# Altium schematic sheet Schematic.SchDoc: Đo dòng và áp không sử dụng ADC
size A3; DrawnBy: Đinh Anh Tú; Organization: Thiết kế Thiết bị đo 20211:; Address1: Phạm Thị Trang; Address2: Đào Phi Dương; Address3: Đinh Anh Tú; DocumentNumber: 01; Revision: V2.1; SheetNumber: 01; SheetTotal: 01
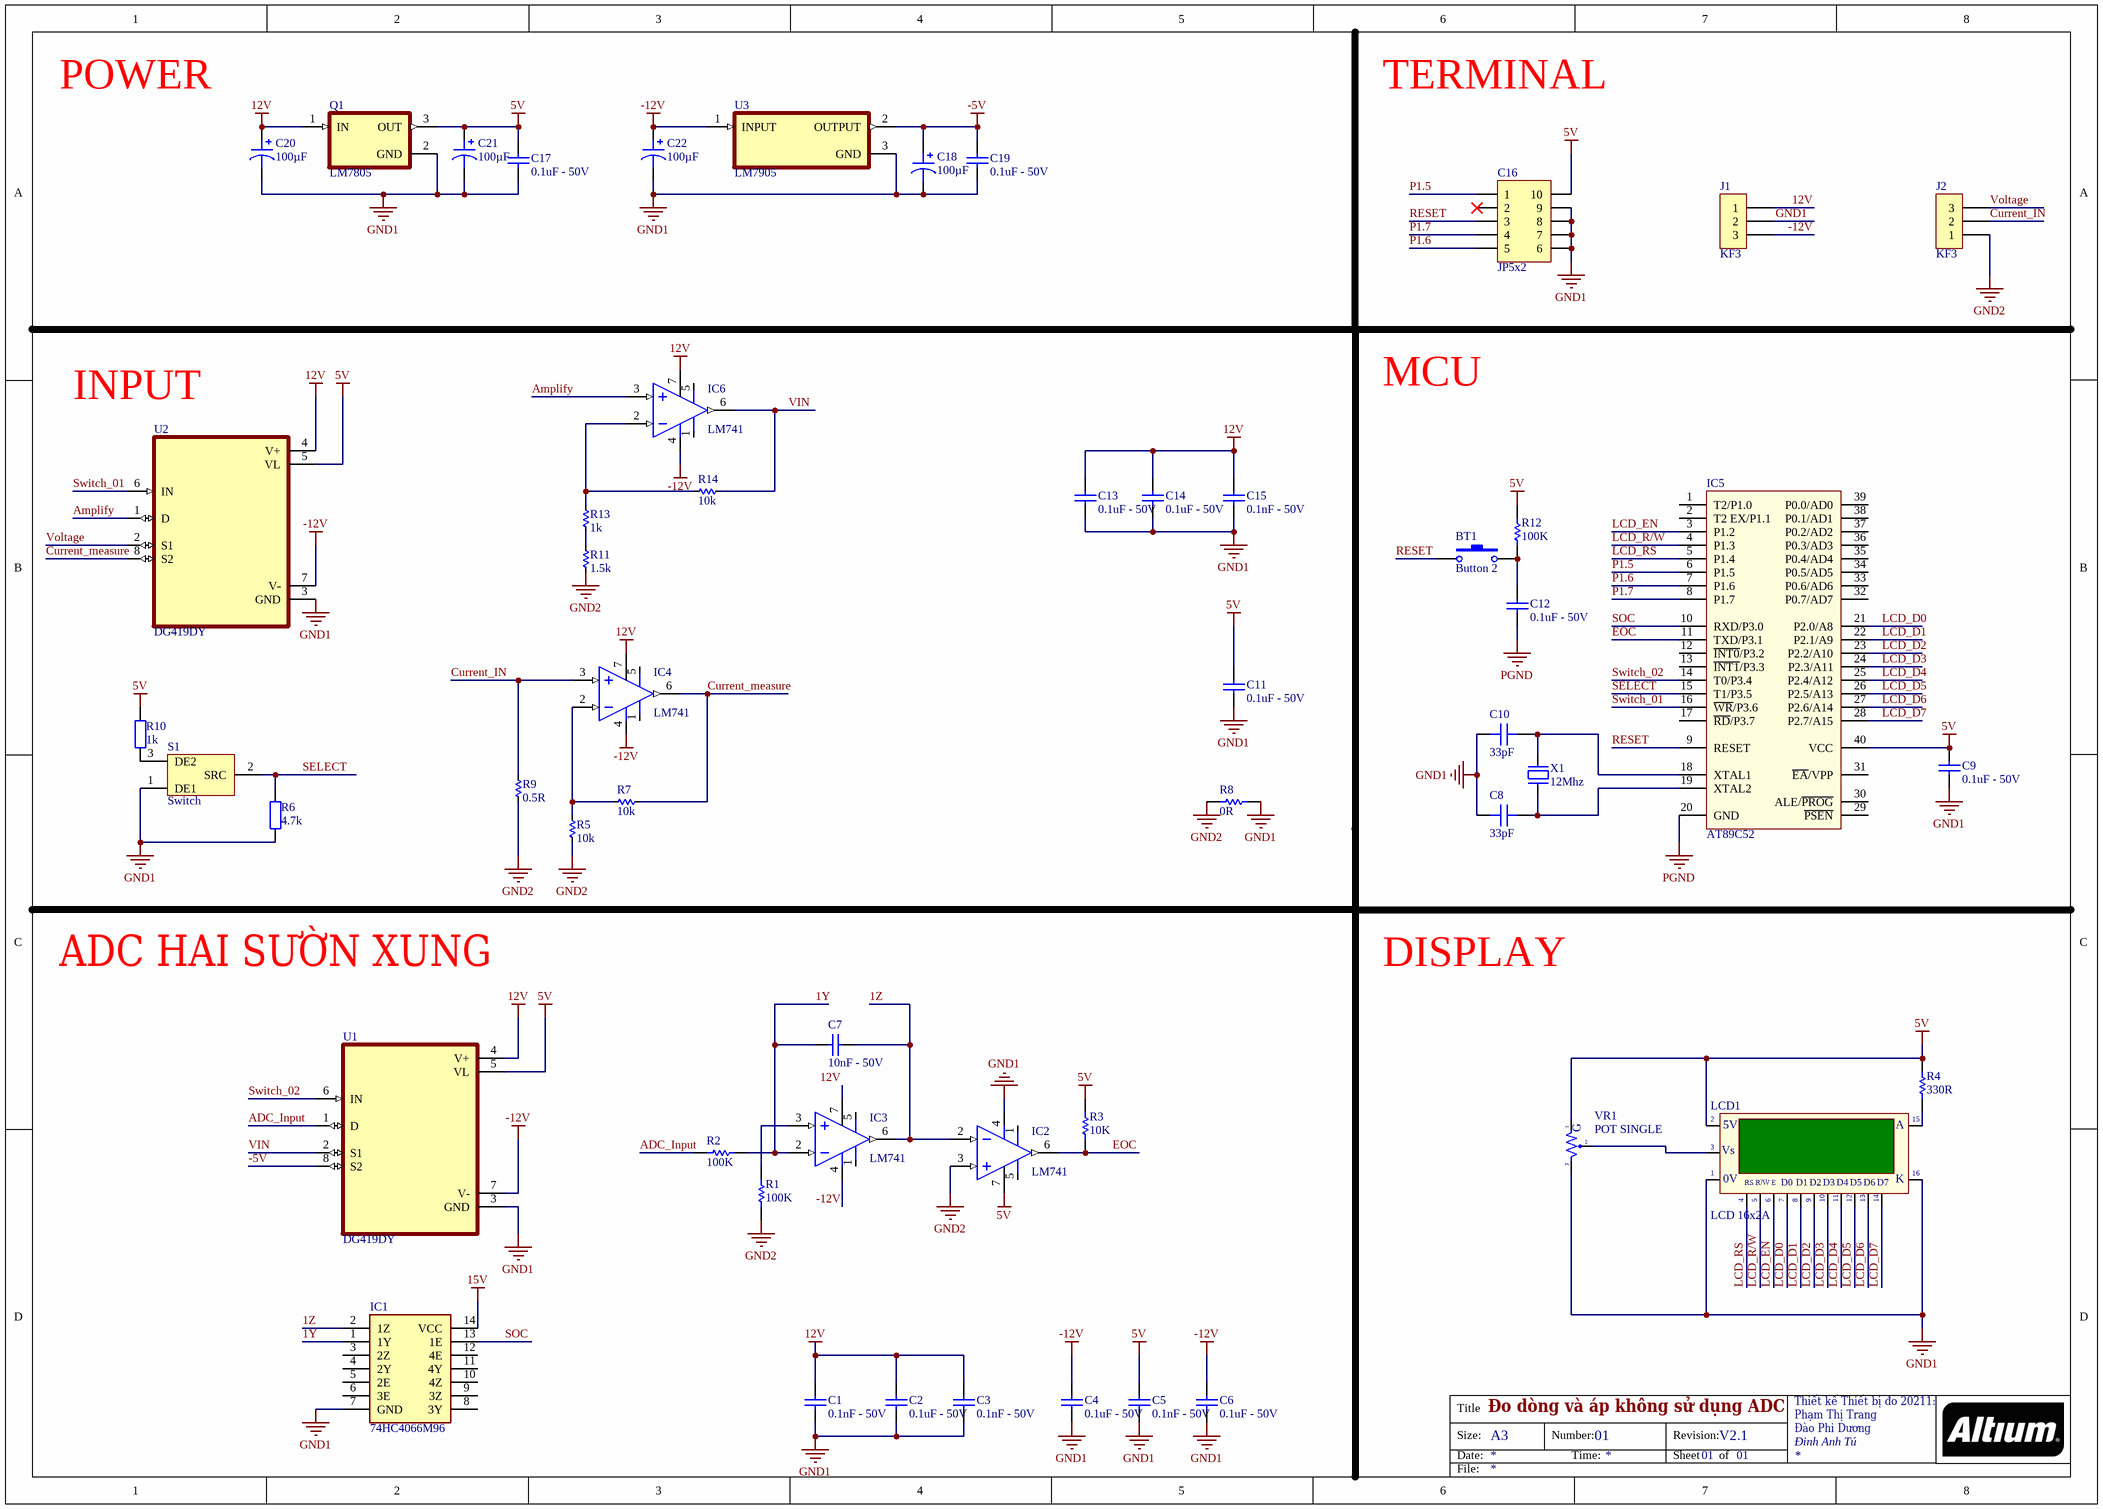
[diagram p0: Schematic.SchDoc]

## Parts
BT1  Button 2  [4341x10438x6_6x3.5x4.3]
C1  0.1nF - 50V  [CAPC_0603_N]
C2  0.1uF - 50V  [CAPC_0603_N]
C3  0.1nF - 50V  [CAPC_0603_N]
C4  0.1uF - 50V  [CAPC_0603_N]
C5  0.1nF - 50V  [CAPC_0603_N]
C6  0.1uF - 50V  [CAPC_0603_N]
C7  10nF - 50V  [CAPC_0603_N]
C8  33pF  [CAP 0805_2012]
C9  0.1uF - 50V  [CAPC_0603_N]
C10  33pF  [CAP 0805_2012]
C11  0.1uF - 50V  [CAPC_0603_N]
C12  0.1uF - 50V  [CAPC_0603_N]
C13  0.1uF - 50V  [CAPC_0603_N]
C14  0.1uF - 50V  [CAPC_0603_N]
C15  0.1nF - 50V  [CAPC_0603_N]
C16  JP5x2  [JP5-D2T]
C17  0.1uF - 50V  [CAPC_0603_N]
C18  100µF  [CAP TH ALUM ELEC D8.00mm S3.50mm H12.50mm]
C19  0.1uF - 50V  [CAPC_0603_N]
C20  100µF  [CAP TH ALUM ELEC D8.00mm S3.50mm H12.50mm]
C21  100µF  [CAP TH ALUM ELEC D8.00mm S3.50mm H12.50mm]
C22  100µF  [CAP TH ALUM ELEC D8.00mm S3.50mm H12.50mm]
IC1  74HC4066M96  [SOIC127P600X175-14N]
IC2  LM741  [SO8]
IC3  LM741  [SO8]
IC4  LM741  [SO8]
IC5  AT89C52  [DIP40/W0.6]
IC6  LM741  [SO8]
J1  KF3  [KF3-5.08]
J2  KF3  [KF3-5.08]
LCD1  LCD 16x2A  [JP16-C1T]
Q1  LM7805  [TO254P1054X470X2600-3]
R1  100K  [RESC_0805_N]
R2  100K  [RESC_0805_N]
R3  10K  [RESC_0603_N]
R4  330R  [RESC_0603_N]
R5  10k  [RES-SMD-0805]
R6  value 4.7k  [DIEN TRO 1/4 W]  (hidden comment: R0.4W)
R7  10k  [RES-SMD-0805]
R8  0R  [RESC_0805_N]
R9  0.5R  [RES-SMD-1206]
R10  value 1k  [DIEN TRO 1/4 W]  (hidden comment: R0.4W)
R11  1.5k  [RES-SMD-0805]
R12  100K  [RESC_0805_N]
R13  1k  [RES-SMD-0805]
R14  10k  [RES-SMD-0805]
S1  Switch  [Switch]
U1  DG419DY  [SOIC127P600X175-8N]
U2  DG419DY  [SOIC127P600X175-8N]
U3  LM7905  [TO254P1054X470X1955-3]
VR1  POT SINGLE  [POTSD 3296V]
X1  12Mhz  [XT2]

## Nets
5V: C5.1 C9.1 C11.1 C16.10 C17.2 C21.1 IC2.7(+V) IC5.40(VCC) LCD1.2(VDD) Q1.3(OUT) R3.1 R4.1 R10.2 R12.1 U1.5(VL) U2.5(VL) VR1.1
12V: C1.1 C2.1 C3.1 C13.1 C14.1 C15.1 C20.1 IC3.7(+V) IC4.7(+V) IC6.7(+V) J1.1 Q1.1(IN) U1.4(V+) U2.4(V+)
15V: IC1.14(VCC)
-5V: C18.1 C19.2 U1.8(S2) U3.2(OUTPUT)
-12V: C4.1 C6.1 C22.1 IC3.4(-V) IC4.4(-V) IC6.4(-V) J1.3 U1.7(V-) U2.7(V-) U3.1(INPUT)
GND1: C1.2 C2.2 C3.2 C4.2 C5.2 C6.2 C8.1 C9.2 C10.1 C11.2 C13.2 C14.2 C15.2 C16.6 C16.7 C16.8 C16.9 C17.1 C18.2 C19.1 C20.2 C21.2 C22.2 IC1.7(GND) IC2.4(-V) J1.2 LCD1.1(GND) LCD1.16(K) Q1.2(GND) R6.1 R8.1 S1.1(DE1) U1.3(GND) U2.3(GND) U3.3(GND) VR1.3
GND2: IC2.3(IN+) J2.1 R1.2 R5.2 R8.2 R9.1 R11.2
PGND: C12.1 IC5.20(GND)
1Y: C7.1 IC1.1(1Y) IC3.2(IN-) R2.1
1Z: C7.2 IC1.2(1Z) IC2.2(IN-) IC3.6(OUT)
ADC_Input: R2.2 U1.1(D)
Amplify: IC6.3(IN+) U2.1(D)
Current_IN: IC4.3(IN+) J2.2 R9.2
Current_measure: IC4.6(OUT) R7.2 U2.8(S2)
EOC: IC2.6(OUT) IC5.11(TXD/P3.1) R3.2
LCD_D0: IC5.21(P2.0/A8) LCD1.7(D0)
LCD_D1: IC5.22(P2.1/A9) LCD1.8(D1)
LCD_D2: IC5.23(P2.2/A10) LCD1.9(D2)
LCD_D3: IC5.24(P2.3/A11) LCD1.10(D3)
LCD_D4: IC5.25(P2.4/A12) LCD1.11(D4)
LCD_D5: IC5.26(P2.5/A13) LCD1.12(D5)
LCD_D6: IC5.27(P2.6/A14) LCD1.13(D6)
LCD_D7: IC5.28(P2.7/A15) LCD1.14(D7)
LCD_EN: IC5.3(P1.2) LCD1.6(~{EN})
LCD_R/~{W}: IC5.4(P1.3) LCD1.5(R/~{W})
LCD_RS: IC5.5(P1.4) LCD1.4(RS)
P1.5: C16.1 IC5.6(P1.5)
P1.6: C16.5 IC5.7(P1.6)
P1.7: C16.4 IC5.8(P1.7)
RESET: BT1.1 C16.3 IC5.9(RESET)
SELECT: IC5.15(T1/P3.5) R6.2 S1.2(SRC)
SOC: IC1.13(1E) IC5.10(RXD/P3.0)
Switch_01: IC5.16(~{WR}/P3.6) U2.6(IN)
Switch_02: IC5.14(T0/P3.4) U1.6(IN)
VIN: IC6.6(OUT) R14.2 U1.2(S1)
Voltage: J2.3 U2.2(S1)
NetBT1_2: BT1.2 C12.2 R12.2
NetC8_2: C8.2 IC5.19(XTAL2) X1.1
NetC10_2: C10.2 IC5.18(XTAL1) X1.2
NetIC3_3: IC3.3(IN+) R1.1
NetIC4_2: IC4.2(IN-) R5.1 R7.1
NetIC6_2: IC6.2(IN-) R13.1 R14.1
NetLCD1_3: LCD1.3(VEE) VR1.2
NetLCD1_15: LCD1.15(A) R4.2
NetR10_1: R10.1 S1.3(DE2)
NetR11_1: R11.1 R13.2

Not connected (* = marked no-connect by the designer): C16 2*; IC1 3(2Z) 4(2Y) 5(2E) 6(3E) 8(3Y) 9(3Z) 10(4Z) 11(4Y) 12(4E); IC2 1(Vos) 5(Vos); IC3 1(Vos) 5(Vos); IC4 1(Vos) 5(Vos); IC5 1(T2/P1.0) 2(T2_EX/P1.1) 12(~{INT0}/P3.2) 13(~{INT1}/P3.3) 17(~{RD}/P3.7) 29(~{PSEN}) 30(ALE/~{PROG}) 31(~{EA}/VPP) 32(P0.7/AD7) 33(P0.6/AD6) 34(P0.5/AD5) 35(P0.4/AD4) 36(P0.3/AD3) 37(P0.2/AD2) 38(P0.1/AD1) 39(P0.0/AD0); IC6 1(Vos) 5(Vos); S1 4 5

## Notes on the sheet
- POWER
- TERMINAL
- (near U2) INPUT
- MCU
- ADC HAI SƯỜN XUNG
- DISPLAY
- Title
- Size:
- Date:
- A3
- Number:
- Time:
- Revision:
- Sheet
- of
- File:
- (in symbol LCD16x2A) 5V; Vs; |; 0V; R/W; E
- (in symbol POT SINGLE) G

## Library data of the parts
BT1 = Button 2: Button 2 Pin no Sheld
C1 C3 C5 C15 = CL10B101KB8NNNC: CAP CER 100PF 50V X7R 0603; Manufacture: Samsung Electro-Mechanics; Detailed Value: 0.1nF - 50V - 0603; PROJECT: KHO; Partnumber: CL10B101KB8NNNC; Value: 0.1nF - 50V; Creator: ThangND; Category: Capacitor; Mounting type: SMD
C2 C9 C12-C14 C17 C19 = C0603X7R104K500NT: CAP CER 0.1UF 50V X7R 0603; Manufacture: Hottech; Detailed Value: 0.1uF - 50V - 0603; PROJECT: KHO; Partnumber: C0603X7R104K500NT; Value: 0.1uF - 50V; Creator: ThangND; Category: Capacitor; Mounting type: SMD
C4 C6 C11 = CL10B104KB8NNNC: CAP CER 0.1UF 50V X7R 0603; Manufacture: Samsung Electro-Mechanics; Detailed Value: 0.1uF - 50V - 0603; PROJECT: KHO; Partnumber: CL10B104KB8NNNC; Value: 0.1uF - 50V; Creator: ThangND; Category: Capacitor; Mounting type: SMD
C7 = C0603X7R103J500NT: CAP CER 10000PF 50V X7R 0603; Manufacture: Hottech; Detailed Value: 10nF - 50V - 0603; PROJECT: KHO; Partnumber: C0603X7R103J500NT; Value: 10nF - 50V; Creator: ThangND; Category: Capacitor; Mounting type: SMD
C8 C10 = CBR08C330JAGAC: CAP CER 33PF 250V C0G/NP0 0805; Manufacturer: KEMET; Temperature Coefficient: C0G, NP0; Tolerance: ±5%; Part Number: CBR08C330JAGAC; Value: 33pF; Applications: RF, Microwave, High Frequency; Capacitance: 33pF; ComponentLink1Description: Datasheet; ComponentLink1URL: https://api.kemet.com/component-edge/download/datasheet/CBR08C330JAGAC.pdf; ComponentLink2Description: DigiKey Link; ComponentLink2URL: http://digikey.com/product-detail/en/kemet/CBR08C330JAGAC/399-6202-1-ND/2732182; Device Package: 0805 (2012 Metric); Features: High Q, Low Loss, Ultra Low ESR; LastUpdated: 9/2/2020 1:04:42 AM; Lifecycle Status: Active; Minimum Order: 1; Mounting Type: Surface Mount, MLCC; Operating Temperature: -55°C ~ 125°C; Package / Case: 0805 (2012 Metric); Packaging: TapeAndReel; PartId: 2409; Part Status: Active; Price: 0.44; Series: CBR-SMD RF C0G; Size / Dimension: 0.079" L x 0.049" W (2.00mm x 1.25mm); Supplier 1: DigiKey; Supplier Part Number 1: 399-6202-1-ND; Thickness (Max): 0.035" (0.88mm); Voltage - Rated: 250V
C16 = JP5x2: WR-PHD 2.54 mm Dual Socket Header; Manufacturer: W¨¹rth Elektronik eiSos GmbH; partNo: 61301021821; ComponentLink1 Description: Manufacturer; ComponentLink2 Description: Datasheet; NoPins: 10; Created Date: 29 March 2013; ComponentLink1URL: http://www.we-online.com; ComponentLink2URL: http://katalog.we-online.de/em/datasheet/6130xx21821.pdf; Created by: Karrer Zheng
C18 C20-C22 = ECA-1HM101: CAP ALUM 100UF 20% 50V RADIAL; Manufacturer: Panasonic Electronic Components; Lifetime @ Temp.: 2000 Hrs @ 85°C; Polarization: Polar; Ripple Current @ High Frequency: 425mA @ 10kHz; Ripple Current @ Low Frequency: 250mA @ 120Hz; Part Number: ECA-1HM101; Applications: General Purpose; Capacitance: 100µF; ComponentLink1Description: Datasheet; ComponentLink1URL: //media.digikey.com/pdf/Data%20Sheets/Panasonic%20Electronic%20Components/ECA-xxM%20Series,TypeA.pdf; ComponentLink2Description: DigiKey Link; ComponentLink2URL: http://digikey.com/product-detail/en/panasonic-electronic-components/ECA-1HM101/P5182-ND/245041; Device Package: Radial, Can; Height - Seated (Max): 0.492" (12.50mm); LastUpdated: 9/7/2020 5:24:52 AM; Lead Spacing: 0.138" (3.50mm); Lifecycle Status: Active; Minimum Order: 1; Mounting Type: Through Hole; Operating Temperature: -40°C ~ 85°C; Package / Case: Radial, Can; Packaging: Bulk; PartId: 7199; Part Status: Active; Price: 0.31; Series: M; Size / Dimension: 0.315" Dia (8.00mm); Supplier 1: DigiKey; Supplier Part Number 1: P5182-ND; Tolerance: ±20%; Value: 100µF; Voltage - Rated: 50V
IC1 = CD74HC4066M96: Integrated Circuit; Manufacturer_Name: Texas Instruments; Datasheet Link: http://www.ti.com/lit/gpn/cd74hc4066; Height: 1.75mm; Manufacturer_Part_Number: CD74HC4066M96; Mouser Part Number: 595-CD74HC4066M96; Mouser Price/Stock: https://www.mouser.co.uk/ProductDetail/Texas-Instruments/CD74HC4066M96?qs=3pnr37ZAbK%2F2%2FQ8j7WB7Tw%3D%3D; Arrow Part Number: CD74HC4066M96; Arrow Price/Stock: https://www.arrow.com/en/products/cd74hc4066m96/texas-instruments
IC2-IC4 IC6 = LM741: Single OA
IC5 = AT89C52: Atmel AT89C52, 8k Byte Flash Memory , 40 Pin; Value: AT89C52
J1 J2 = KF3: Manufacturer: Würth Elektronik eiSos GmbH; partNo: 691103110003; ComponentLink1 Description: Manufacturer; ComponentLink2 Description: Datasheet; NoPins: 3; Created Date: 29 October 2013; ComponentLink1URL: http://www.we-online.com; ComponentLink2URL: http://katalog.we-online.de/em/datasheet/6911031100xx.pdf; Created by: Karrer Zheng
LCD1 = LCD16x2A: LCD dipslay 16 char, 2 line; Value: LCD16x2A
Q1 = LM7805CT/NOPB: Linear Voltage Regulator IC 1 Output 1A TO-220-3; MF: ON Semiconductor; MP: LM7805CT; SnapEDA_Link: https://www.snapeda.com/parts/LM7805CT/ON%20Semiconductor/view-part/546231/?ref=snap; Price: None; Package: TO-220 ON Semiconductor; Value: *; Availability: Unavailable
R1 R2 R12 = RC0805JR-07100KL: RES SMD 100K OHM 5% 1/8W 0805; Manufacture: Yageo; Detailed Value: 100K-5%-1/8W; PROJECT: NEED PURCHASE; Partnumber: RC0805JR-07100KL; Value: 100K; Creator: Tunn; Category: Resistor; Mounting type: SMD; Supplier: Digikey
R3 = RI0603L1002FT: RES SMD 10K OHM 1% 1/10W 0603; Manufacture: Hottech; Detailed Value: 10K - 1% - 1/10W; PROJECT: KHO; Partnumber: RI0603L1002FT; Value: 10K; Creator: anhdn; Category: Resistor; Mounting type: SMD
R4 = RI0603L3300FT: RES SMD 330 OHM 1% 1/10W 0603; Manufacture: Hottech; Detailed Value: 330R - 1% - 1/10W; PROJECT: KHO; Partnumber: RI0603L3300FT; Value: 330R; Creator: anhdn; Category: Resistor; Mounting type: SMD
R5 R7 R9 R11 R13 R14 = Res-SMD: Resistor; Manufacturer: Generic Components; Class: Passive; Published: 08/06/2000; Publisher: Altium Hobart Technology Centre
R6 R10 = Res 1/4 W: Resistor; Published: 8-Jun-2000; LatestRevisionDate: 17-Jul-2002; LatestRevisionNote: Re-released for DXP Platform.; PackageReference: AXIAL-0.4; Publisher: Altium Limited
R8 = RC0805JR-070RL: RES SMD 0 OHM JUMPER 1/8W 0805; Manufacture: Yageo; Detailed Value: 0 OHM - 1/8W; PROJECT: KHO; Partnumber: RC0805JR-070RL; Value: 0R; Creator: anhdn; Category: Resistor; Mounting type: SMD
U3 = LM7905CT/NOPB: 1.5-A, negative linear voltage regulator 3-TO-220 0 to 125; MF: Texas Instruments; Value: *; Mouser-Purchase-URL: https://snapeda.com/shop?store=Mouser&id=6864; MP: LM7905CT/NOPB; DigiKey-Purchase-URL: https://snapeda.com/shop?store=DigiKey&id=6864; Package: TO-220-3 Texas Instruments; Price: None; Texas_Instruments-Purchase-URL: https://snapeda.com/shop?store=Texas+Instruments&id=6864; SnapEDA_Link: https://www.snapeda.com/parts/LM7905CT/NOPB/Texas%20Instruments/view-part/6864/?ref=snap; Availability: Unavailable
VR1 = POT SINGLE: Var Resistor
X1 = XT2: Crystal, 32.768 KHz, -40 to 85 degC, 3.2 x 1.5 x 0.9 mm SMD; Value: 4Mhz
U1 U2 = DG419DY: Package: None; Price: None; Value: *; MP: DG419DY; Availability: Unavailable